# EAGLE design usb (EAGLE 6.4)
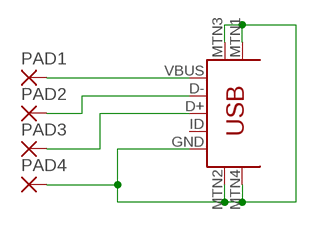
[diagram p0: schematic, sheet 1]

## Parts
PAD1  SMD2  [SMD1,27-2,54]
PAD2  SMD2  [SMD1,27-2,54]
PAD3  SMD2  [SMD1,27-2,54]
PAD4  SMD2  [SMD1,27-2,54]
USB1  USB-MINIB-5PIN  [USB-MINIB]

## Nets
GND: PAD4.1(P) USB1.GND USB1.MTN1(MTN2) USB1.MTN2(MTN3) USB1.MTN3(MTN1) USB1.MTN4
N$1: PAD1.1(P) USB1.VBUS
N$2: PAD2.1(P) USB1.D-
N$3: PAD3.1(P) USB1.D+
Unconnected: USB1.ID

## Library data of the parts
PAD1-PAD4 = wirepad:SMD2: SMD PAD
USB1 = SparkFun-Connectors:USB-MINIB: Mini-USB "B" connector with 5th pin broken out. Created new symbol breaking out 5th "ID" pin in mini/micro USB connector spec. See: http://en.wikipedia.org/wiki/Mini_usb#Cables. Uses same footprint as 4-pin symbol. Also added pins to connect to mounting / shield pads if required (probably not generally needed as signals aren't shielded once they leave the connector).

## Board
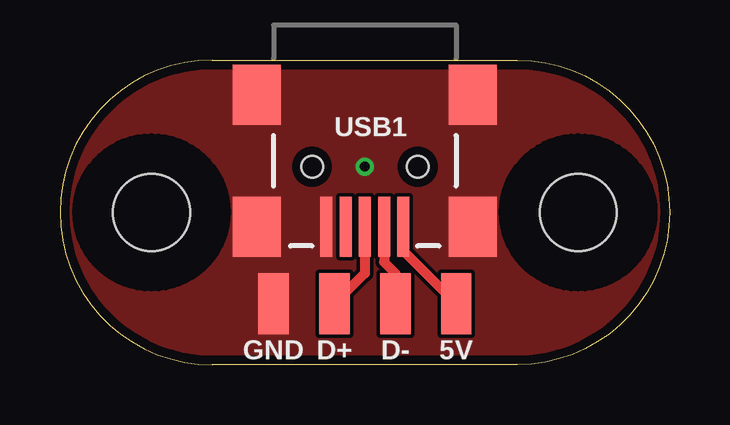
[diagram p1: board, top side]
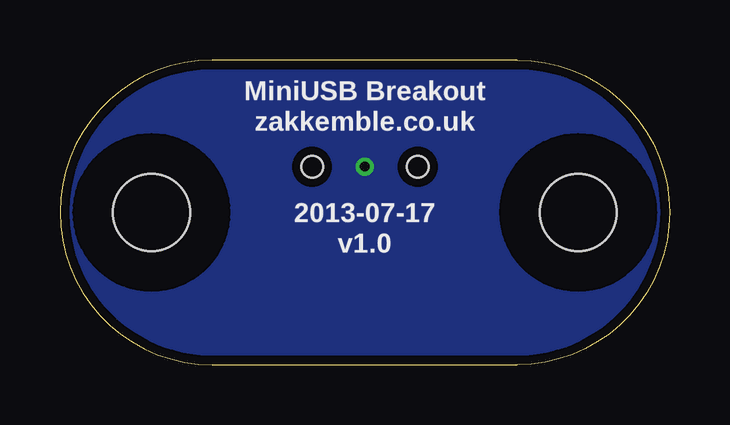
[diagram p2: board, bottom side, seen from below]

Size 25.4 x 12.7 mm. Coordinates in mm from the lower left corner, seen from the top.
Outline: 19.05,12.7 arc-90 25.4,6.35 arc-90 19.05,0 6.35,0 arc-90 0,6.35 arc-90 6.35,12.7 19.05,12.7
Copper layers (1*16): Top 0.0356mm / dielectric 1.5011mm / Bottom 0.0356mm
Design rules "LaenPCBOrder *": minimum track width 6mil, minimum drill 13mil, track to track 6mil, track to pad 6mil, pad to pad 6mil, via to via 6mil, smd to smd 6mil, copper to edge 15mil, drill to drill 6mil, minimum pad ring 7mil, minimum via ring 7mil, stop-mask expansion 4mil, vias tented up to drill 26mil, thermal gap 10mil
Holes 3.2 mm at 21.59,6.35 3.81,6.35
tRestrict: area 18.4,3.2 to 24.8,9.5; area 0.6,3.2 to 7,9.5
bRestrict: area 0.6,3.2 to 7,9.5; area 18.4,3.2 to 24.8,9.5

### Footprints (pad centres in the part's own frame; a part is rotated, then mirrored left to right if it is on the bottom)
SMD1,27-2,54 = smd 1.27 x 2.54: 1 0,0
USB-MINIB = smd 2.5 x 0.5: D+ 2.5,0; D- 2.5,0.8; GND 2.5,-1.6; ID 2.5,-0.8; VBUS 2.5,1.6 | smd 2.5 x 2: MTN1 -3,4.5; MTN2 2.5,4.5; MTN3 -3,-4.5; MTN4 2.5,-4.5 | hole 0.9: 0,2.2; 0,-2.2

### Placement (x,y rotation side)
PAD1  16.51,2.54 0 top
PAD2  13.97,2.54 0 top
PAD3  11.43,2.54 0 top
PAD4  8.89,2.54 0 top
USB1  12.7,8.26 270 top

### Tracks (layer width: path | path; a pad name or v marks a point on that pad's centre or on a via)
GND  (via drill 0.4)
  other vias: 12.7,8.26
  pour Top (no thermals): 25.4,12.7 25.4,0 0,0 0,12.7
  pour Bottom (no thermals): 0,0 0,12.7 25.4,12.7 25.4,0
N$1
  Top 0.406: USB1.VBUS 14.3,4.75 PAD1.1
N$2
  Top 0.406: USB1.D- 13.5,4.28 13.97,3.81 PAD2.1
N$3
  Top 0.406: USB1.D+ 12.7,3.81 PAD3.1

### Text on the board
tPlace: GND | D+ | D- | 5V
bPlace: MiniUSB Breakout | zakkemble.co.uk | 2013-07-17 | v1.0